# EAGLE design IoTNodeWeatherandWaterAdapterFeb2019v0 (EAGLE 9.3.0)
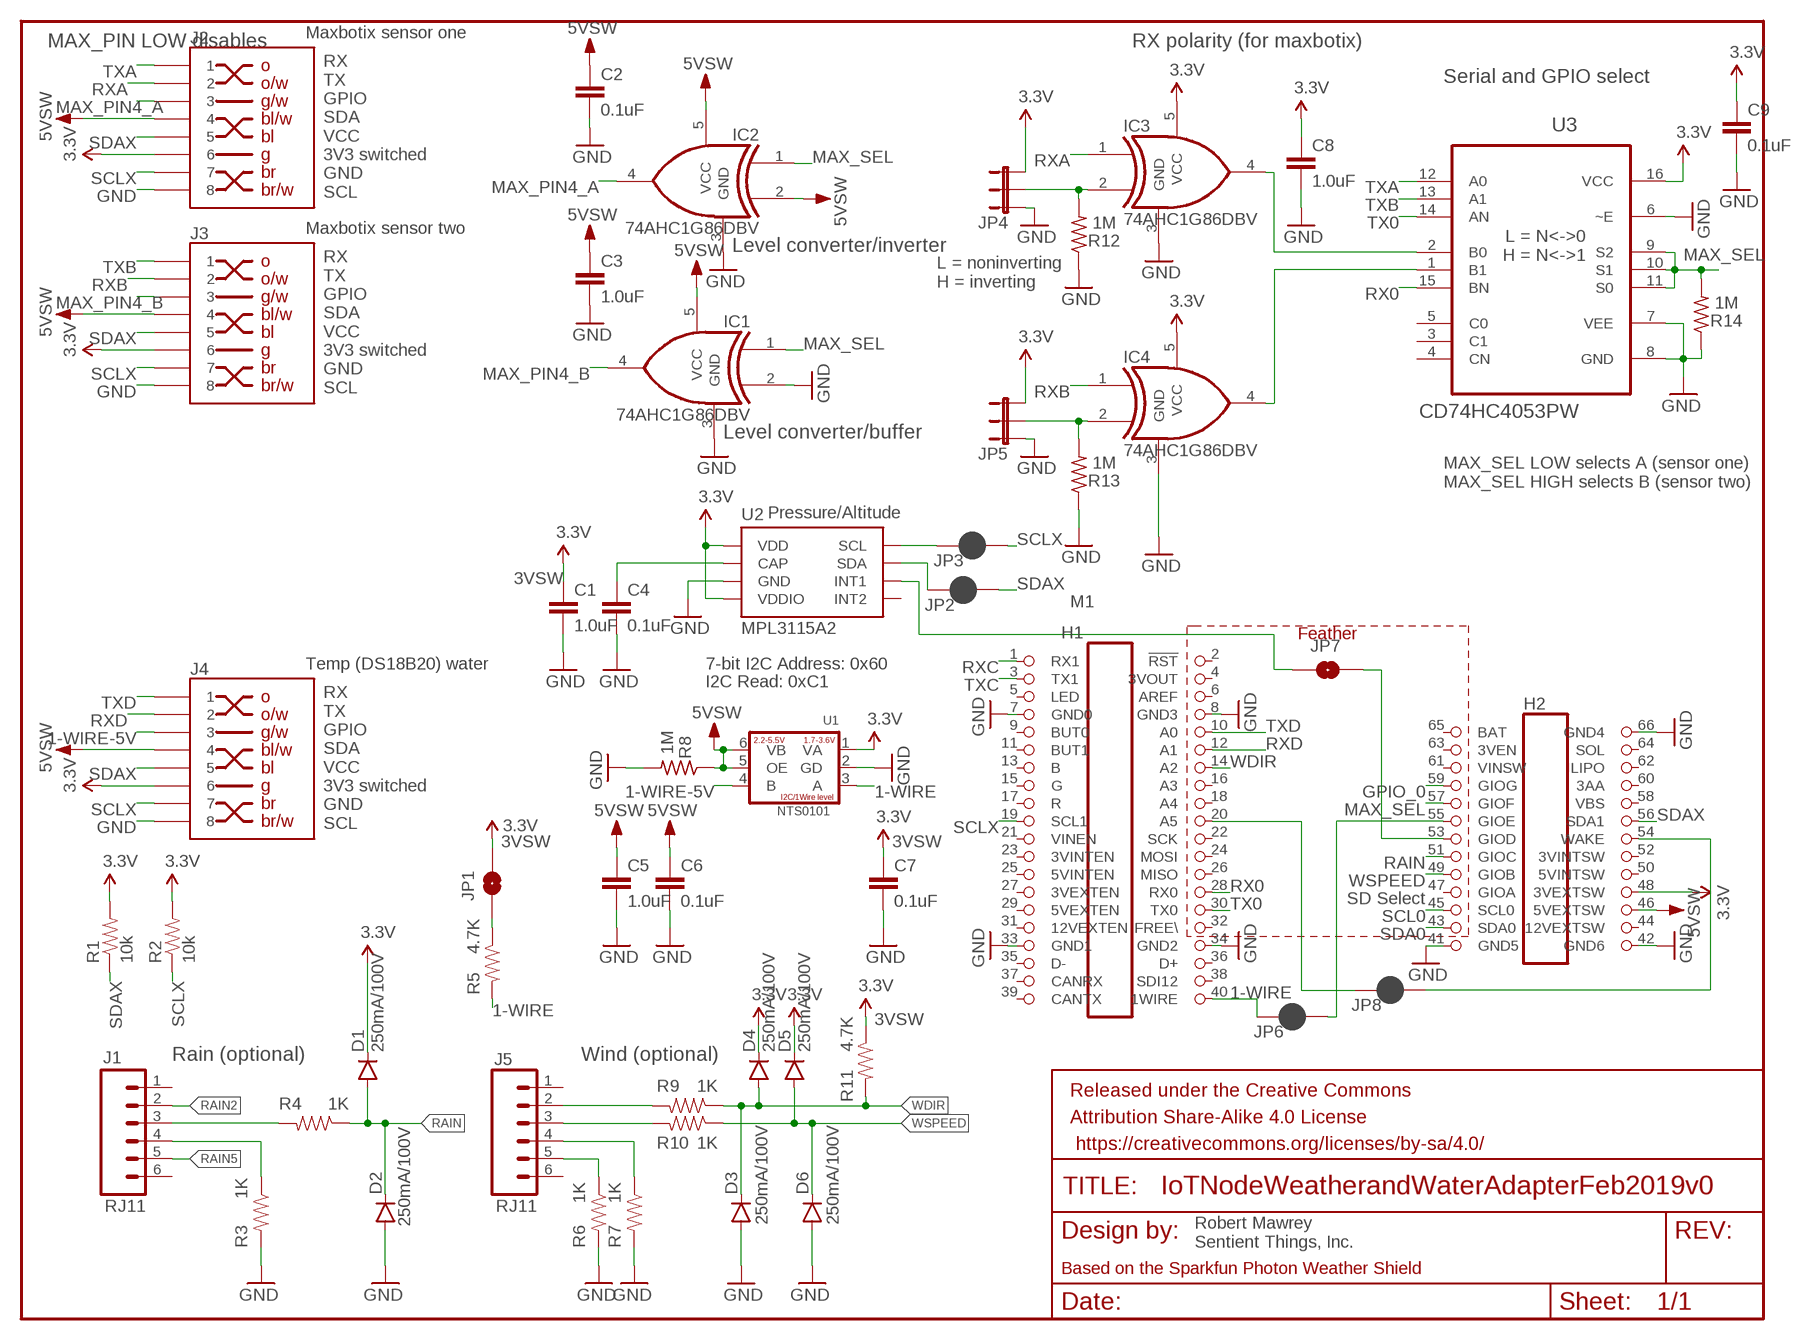
[diagram p0: schematic, sheet 1]

## Parts
C1  1.0uF  1.0UF-16V-10%(0603)  [0603-CAP]
C2  0.1uF  0.1UF-25V(+80/-20%)(0603)  [0603-CAP]
C3  1.0uF  1.0UF-16V-10%(0603)  [0603-CAP]
C4  0.1uF  0.1UF-25V(+80/-20%)(0603)  [0603-CAP]
C5  1.0uF  1.0UF-16V-10%(0603)  [0603-CAP]
C6  0.1uF  0.1UF-25V(+80/-20%)(0603)  [0603-CAP]
C7  0.1uF  0.1UF-25V(+80/-20%)(0603)  [0603-CAP]
C8  1.0uF  1.0UF-16V-10%(0603)  [0603-CAP]
C9  0.1uF  0.1UF-25V(+80/-20%)(0603)  [0603-CAP]
D1  250mA/100V  DIODEBAS16  [SOD-323]
D2  250mA/100V  DIODEBAS16  [SOD-323]
D3  250mA/100V  DIODEBAS16  [SOD-323]
D4  250mA/100V  DIODEBAS16  [SOD-323]
D5  250mA/100V  DIODEBAS16  [SOD-323]
D6  250mA/100V  DIODEBAS16  [SOD-323]
FRAME1  FRAME-LETTER  [CREATIVE_COMMONS]
H1  IOTNODE2X20PLACEMENT  [2X20PLACEMENT]
H2  IOTNODE2X13PLACEMENT  [2X13PLACEMENT]
IC1  74AHC1G86DBV  [SOT23-5]
IC2  74AHC1G86DBV  [SOT23-5]
IC3  74AHC1G86DBV  [SOT23-5]
IC4  74AHC1G86DBV  [SOT23-5]
J1  RJ11  RJ11-6PTH  [RJ11-6]
J2  RJ45-8-UP  [RJHSE-5080]
J3  RJ45-8-UP  [RJHSE-5080]
J4  RJ45-8-UP  [RJHSE-5080]
J5  RJ11  RJ11-6PTH  [RJ11-6]
JP1  JUMPER-PAD-2-NOYES_SILK  [PAD-JUMPER-2-NO_YES_SILK]
JP2  JUMPER-SMT_2_NC_PASTE_NO-SILK  [SMT-JUMPER_2_NC_PASTE_NO-SILK]
JP3  JUMPER-SMT_2_NC_PASTE_NO-SILK  [SMT-JUMPER_2_NC_PASTE_NO-SILK]
JP4  JUMPER-3LOCK  [1X03_LOCK]
JP5  JUMPER-3LOCK  [1X03_LOCK]
JP6  JUMPER-SMT_2_NC_PASTE_NO-SILK  [SMT-JUMPER_2_NC_PASTE_NO-SILK]
JP7  JUMPER-SMT_2_NO_NO-SILK  [SMT-JUMPER_2_NO_NO-SILK]
JP8  JUMPER-SMT_2_NC_PASTE_NO-SILK  [SMT-JUMPER_2_NC_PASTE_NO-SILK]
M1  IOTNODEFEATHERWING  [IOTNODEFEATHERWING]
R1  10k  RESISTOR0603-RES  [0603-RES]
R2  10k  RESISTOR0603-RES  [0603-RES]
R3  1K  1KOHM-1/10W-1%(0603)  [0603-RES]
R4  1K  1KOHM-1/10W-1%(0603)  [0603-RES]
R5  4.7K  4.7KOHM-1/10W-1%(0603)  [0603-RES]
R6  1K  1KOHM-1/10W-1%(0603)  [0603-RES]
R7  1K  1KOHM-1/10W-1%(0603)  [0603-RES]
R8  1M  R_0603  [0603]
R9  1K  1KOHM-1/10W-1%(0603)  [0603-RES]
R10  1K  1KOHM-1/10W-1%(0603)  [0603-RES]
R11  4.7K  4.7KOHM-1/10W-1%(0603)  [0603-RES]
R12  1M  R_0603  [0603]
R13  1M  R_0603  [0603]
R14  1M  R_0603  [0603]
U1  NTS0101  NTS0101-SC-88  [SOT363_PHILIPS]
U2  MPL3115A2  [LGA-8-5X3]
U3  CD74HC4053PW  [SOP65P640X120-16N]

## Nets
1-WIRE: JP6.2 M1.40(1WIRE) R5.2 U1.3(A)
1-WIRE-5V: J4.3 U1.4(B)
3VSW: C1.1 C7.1 C8.1 C9.1 D1.C D4.C D5.C IC3.5(VCC) IC4.5(VCC) J2.6 J3.6 J4.6 JP1.2 JP4.3 JP5.3 M1.48(3VEXTSW) R1.2 R2.2 R11.1 U1.1(VA) U2.1(VDD) U2.4(VDDIO) U3.16(VCC) ; supply symbol labelled 3.3V
5VSW [Power]: C2.1 C3.1 C5.1 C6.1 IC1.5(VCC) IC2.2(I1) IC2.5(VCC) J2.4 J3.4 J4.4 M1.46(5VEXTSW) R8.1 U1.5(OE) U1.6(VB)
GND [Power]: C1.2 C2.2 C3.2 C4.2 C5.2 C6.2 C7.2 C8.2 C9.2 D2.A D3.A D6.A IC1.2(I1) IC1.3(GND) IC2.3(GND) IC3.3(GND) IC4.3(GND) J2.8 J3.8 J4.8 JP4.1 JP5.1 M1.7(GND0) M1.8(GND3) M1.33(GND1) M1.34(GND2) M1.41(GND5) M1.42(GND6) M1.66(GND4) R3.2 R6.2 R7.2 R8.2 R12.1 R13.1 R14.1 U1.2(GD) U2.3(GND) U3.6(~E) U3.7(VEE) U3.8(GND)
GPIO_0: M1.59(GIOG)
MAX_PIN4_A: IC2.4(O) J2.3
MAX_PIN4_B: IC1.4(O) J3.3
MAX_SEL: IC1.1(I0) IC2.1(I0) M1.57(GIOF) R14.2 U3.9(S2) U3.10(S1) U3.11(S0)
N$1: J5.3 R10.2
N$2: J5.2 R9.2
N$4: J1.3 R4.2
N$5: C4.1 U2.2(CAP)
N$9: JP6.1 M1.55(GIOE)
N$10: JP7.1 U2.6(INT1)
N$11: J1.4 R3.1
N$12: J5.5 R6.1
N$13: J5.4 R7.1
N$14: IC3.4(O) U3.2(B0)
N$15: IC4.4(O) U3.1(B1)
N$17: JP8.2 M1.20(A5)
N$18: JP7.2 M1.53(GIOD)
N$22: IC4.2(I1) JP5.2 R13.2
N$23: JP3.2 U2.8(SCL)
N$25: JP8.1 M1.54(WAKE)
N$26: JP2.2 U2.7(SDA)
N$28: JP1.1 R5.1
RA: IC3.2(I1) JP4.2 R12.2
RAIN: D1.A D2.C M1.51(GIOC) R4.1
RAIN2: J1.2
RAIN5: J1.5
RX0: M1.28(RX0) U3.15(BN)
RXA: IC3.1(I0) J2.2
RXB: IC4.1(I0) J3.2
RXC: M1.1(RX1)
RXD: J4.2 M1.12(A1)
SCL0: M1.45(SCL0)
SCLX: J2.7 J3.7 J4.7 JP3.1 M1.19(SCL1) R2.1
SDA0: M1.43(SDA0)
SDAX: J2.5 J3.5 J4.5 JP2.1 M1.56(SDA1) R1.1
TX0: M1.30(TX0) U3.14(AN)
TXA: J2.1 U3.12(A0)
TXB: J3.1 U3.13(A1)
TXC: M1.3(TX1)
TXD: J4.1 M1.10(A0)
WDIR: D3.C D4.A M1.14(A2) R9.1 R11.2
WSPEED: D5.A D6.C M1.49(GIOB) R10.1
Unconnected: J1.1 J1.6 J5.1 J5.6 M1.2(!RST) M1.4(3VOUT) M1.5(LED) M1.6(AREF) M1.9(BUT0) M1.11(BUT1) M1.13(B) M1.15(G) M1.16(A3) M1.17(R) M1.18(A4) M1.21(VINEN) M1.22(SCK) M1.23(3VINTEN) M1.24(MOSI) M1.25(5VINTEN) M1.26(MISO) M1.27(3VEXTEN) M1.29(5VEXTEN) M1.31(12VEXTEN) M1.32(FREE\) M1.35(D-) M1.36(D+) M1.37(CANRX) M1.38(SDI12) M1.39(CANTX) M1.44(12VEXTSW) M1.47(GIOA) M1.50(5VINTSW) M1.52(3VINTSW) M1.58(VBS) M1.60(3AA) M1.61(VINSW) M1.62(LIPO) M1.63(3VEN) M1.64(SOL) M1.65(BAT) U2.5(INT2) U3.3(C1) U3.4(CN) U3.5(C0)

## Notes on the sheet
- Maxbotix sensor one
- MAX_PIN LOW disables | RX polarity (for maxbotix)
- Serial and GPIO select
- RX
  TX
  GPIO
  SDA
  VCC
  3V3 switched
  GND
  SCL
- Maxbotix sensor two
- Level converter/inverter
- L = N<->0
  H = N<->1
- L = noninverting
  H = inverting
- RX
  TX
  GPIO
  SDA
  VCC
  3V3 switched
  GND
  SCL
- Level converter/buffer
- MAX_SEL LOW selects A (sensor one)
  MAX_SEL HIGH selects B (sensor two)
- Pressure/Altitude
- Temp (DS18B20) water | 7-bit I2C Address: 0x60
- I2C Read: 0xC1
- RX
  TX
  GPIO
  SDA
  VCC
  3V3 switched
  GND
  SCL
- SD Select
- Rain (optional) | Wind (optional)
- Robert Mawrey
  Sentient Things, Inc.
- Based on the Sparkfun Photon Weather Shield

## Library data of the parts
C1 C3 C5 C8 = SparkFun-Capacitors:1.0UF-16V-10%(0603): CAP-00868; PARTNO: CC0603KRX7R8BB105; PROD_ID: CAP-00868
C2 C4 C6 C7 C9 = SparkFun-Capacitors:0.1UF-25V(+80/-20%)(0603): CAP-00810 Ceramic Standard decoupling cap; PARTNO: C1608X5R1H104K080AA; PROD_ID: CAP-00810
D1-D6 = SparkFun-DiscreteSemi:DIODE: Diode These are standard reverse protection diodes and small signal diodes. SMA package can handle up to about 1A. SOD-323 can handle about 200mA. What the SOD-323 package when ordering, there are some mfgs out there that are 5-pin packages.; PARTNO: BAS16J,135; PROD_ID: DIO-09646
FRAME1 = Mawrey:FRAME-LETTER: Schematic Frame Standard 8.5x11 US Letter frame; PARTNO: DNP
H1 = Mawrey:IOTNODE2X20PLACEMENT
H2 = Mawrey:IOTNODE2X13PLACEMENT
IC1-IC4 = Mawrey:74*1G86: 2-input EXCLUSIV-OR gate; PARTNO: SN74AHC1G86DBVR
J1 J5 = SparkFun-Connectors:RJ11-6: RJ11 Jack Simple 6 pin RJ11 jack. Commonly found on CAT3 devices and Microchip programmers. SKU: PRT-00132; PARTNO: 5555165-1; PROD_ID: CONN-08590
J2-J4 = Mawrey:RJ45-8: RJ45 Jack Simple RJ45, 8-pin connection - connector for common Cat5, Cat5e, and Cat6 Ethernet cables. Footprint not yet proven in production. Connector sku is PRT-00643; Breakout PCB sku is BOB-00716.; PARTNO: RJHSE-5080
JP1 = iotNodeTempIoT Node baseboard2:JUMPER-PAD-2-NO; PARTNO: DNP
JP2 JP3 JP6 JP8 = SparkFun-Jumpers:JUMPER-SMT_2_NC_PASTE: Normally closed solder jumper This jumper has an aperture in the stencil to allow solder paste to bridge the split in the wire so it's normally closed (NC). Wick off the solder to open the connection. Reapply solder to reclose the connection.; PARTNO: DNP
JP4 JP5 = Mawrey:JUMPER-3; PARTNO: 68000-103HLF
JP7 = SparkFun-Jumpers:JUMPER-SMT_2_NO: Normally open jumper This jumper has two pads in close proximity to each other. Apply solder to close the connection. Round pads are easier to solder for beginners, but are a lot larger. SparkFun Product that uses the round pads: SparkFun EL Sequencer <https://www.sparkfun.com/products/12781>; PARTNO: DNP
M1 = Mawrey:IOTNODEFEATHERWING; PARTNO: DNP
R1 R2 = Mawrey:RESISTOR: Resistor Basic schematic elements and footprints for 0603, 1206, and PTH 1/10th watt (small) resistors.; PARTNO: ERJ-3GEYJ103V
R3 R4 R6 R7 R9 R10 = SparkFun-Resistors:1KOHM-1/10W-1%(0603): RES-07856; PARTNO: RC0603JR-071KL; PROD_ID: RES-07856
R5 R11 = SparkFun-Resistors:4.7KOHM-1/10W-1%(0603): RES-07857; PARTNO: RC0603JR-074K7L; PROD_ID: RES-07857
R8 R12-R14 = Particle:R_0603; PARTNO: RC0603FR-071ML
U1 = Mawrey:NTS0101: The NTS0101 is a 1-bit, dual supply translating transceiver with auto direction sensing, that enables bidirectional voltage level translation. I2C or 1-wire.; PARTNO: NTS0101GW,125
U2 = Mawrey:MPL3115A2: NXP MPL3115A2 Digital Altimeter/Pressure Sensor The MPL3115A2 is a compact piezoresistive absolute pressure sensor with an I2C interface. MPL3115 has a wide operating range of 20kPa to 110 kPa, a range that covers all surface elevations on Earth. The fully internally compensated MEMS in conjunction with an embedded high resolution 24-bit equivalent ADC provide accurate pressure [Pascals] /altitude [meters] and temperature [degrees Celsius] data. Datasheet <http://cdn.sparkfun.com/datasheets/Sensors/Pressure/MPL3115A2.pdf> SparkFun Products SparkFun Altitude/Pressure Sensor Breakout - MPL3115A2 <https://www.sparkfun.com/products/11084> (SEN-11084) SparkFun Weather Shield <https://www.sparkfun.com/products/12081> (DEV-12081) SparkFun Photon Weather Shield <https://www.sparkfun.com/products/13630> (DEV-13630); PARTNO: MPL3115A2; PROD_ID: IC-10869
U3 = Texas Instruments_By_element14_Batch_1:CD74HC4053PW: High-Speed CMOS Logic Analog Multiplexers/Demultiplexers; MPN: CD74HC4053PW; OC_FARNELL: 1595410; OC_NEWARK: -; PACKAGE: TSSOP-16; PARTNO: 74HC4053PW,118; SUPPLIER: Texas Instruments

## Net classes
0 default: width 0.254 mm, drill 0.508 mm, clearance 0.203 mm
1 Power: width 0.762 mm, drill 0.508 mm, clearance 0.203 mm

## Board
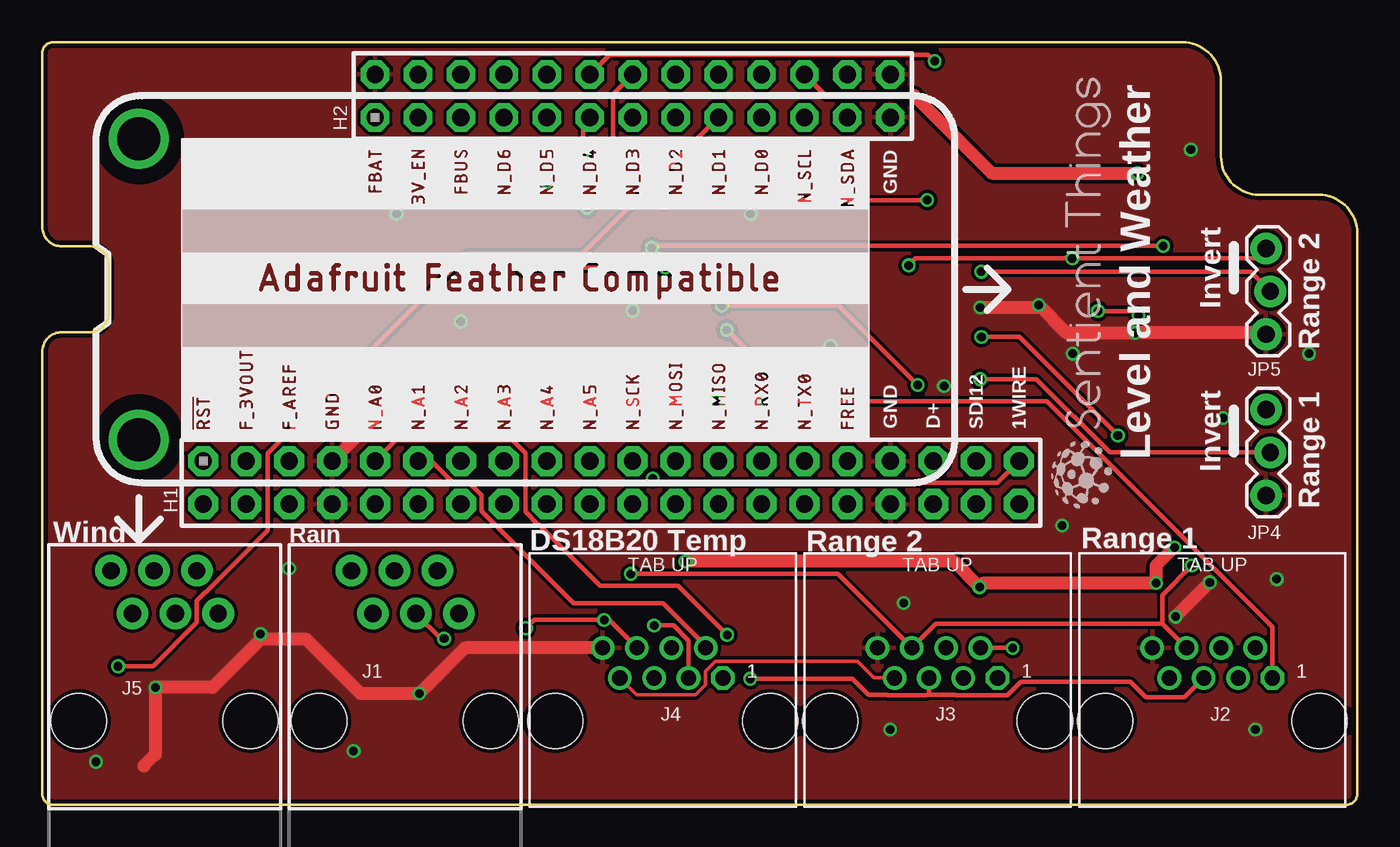
[diagram p1: board, top side]
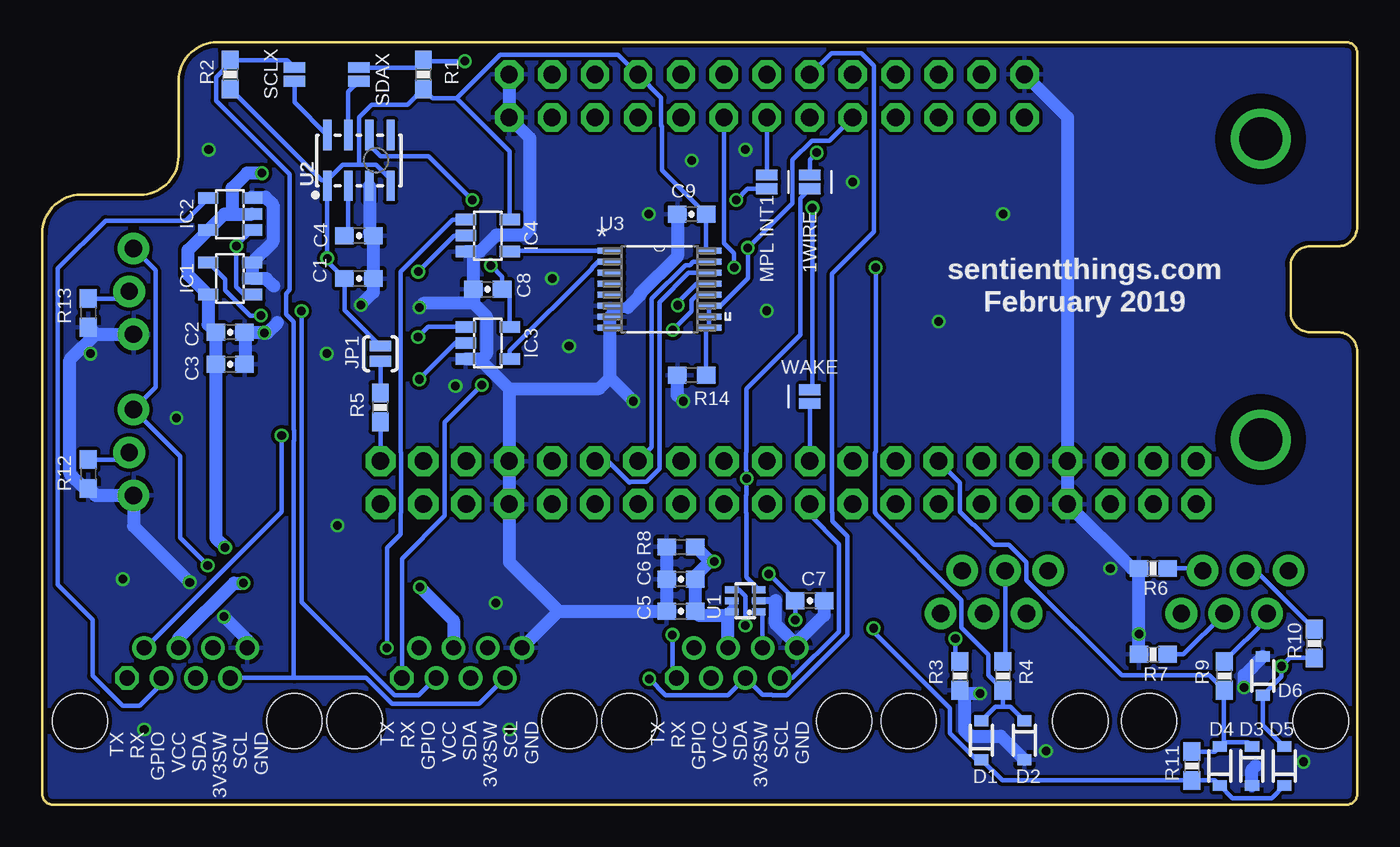
[diagram p2: board, bottom side, seen from below]

Size 77.79 x 45.09 mm. Coordinates in mm from the lower left corner, seen from the top.
Outline: 0,26.8 0,0.64 arc90 0.63,0 77.15,0 arc90 77.79,0.64 77.79,33.78 arc90 75.5,36.07 72.01,36.07 arc-90 69.72,38.35 69.72,42.8 arc90 67.44,45.09 0.63,45.09 arc90 0,44.45 0,34.16 arc90 1.14,33.02 2.79,33.02 arc-90 3.94,31.88 3.94,29.08 arc-90 2.79,27.94 1.14,27.94 arc90 0,26.8
Copper layers (1*16): Top 0.035mm / dielectric 1.5mm / Bottom 0.035mm
Design rules "SeeedStudio_2layer_DRU_no_angle_20140221 *": minimum track width 6mil, minimum drill 20mil, track to track 6mil, track to pad 6mil, pad to pad 6mil, via to via 6mil, smd to smd 0mil, copper to edge 10mil, drill to drill 10mil, minimum pad ring 10mil, minimum via ring 6mil, stop-mask expansion 2mil, vias tented up to drill 100mil, thermal gap 10mil

### Footprints (pad centres in the part's own frame; a part is rotated, then mirrored left to right if it is on the bottom)
0603-CAP = smd 1.1 x 1: 1 -0.85,0; 2 0.85,0
SOD-323 = smd 0.63 x 0.83: A 1.15,0; C -1.15,0
SOT23-5 = smd 0.69 x 1.2: 1 -0.95,-1.3; 2 0,-1.3; 3 0.95,-1.3; 4 0.95,1.3; 5 -0.95,1.3
RJ11-6 = drill 1.016 pad 1.88: 1 -3.175,8.89; 2 -1.905,6.35; 3 -0.635,8.89; 4 0.635,6.35; 5 1.905,8.89; 6 3.175,6.35 | hole 3.251: -5.08,0; 5.08,0
RJHSE-5080 = drill 0.889 octagon: 1 3.556,0 | drill 0.889: 2 2.54,1.778; 3 1.524,0; 4 0.508,1.778; 5 -0.508,0; 6 -1.524,1.778; 7 -2.54,0; 8 -3.556,1.778 | hole 3.251: 6.35,-2.54; -6.35,-2.54
PAD-JUMPER-2-NO_YES_SILK = smd 0.635 x 1.27: 1 -0.45,0; 2 0.45,0
SMT-JUMPER_2_NC_PASTE_NO-SILK = smd 0.635 x 1.27: 1 -0.406,0; 2 0.406,0
1X03_LOCK = drill 1.016 pad 1.88: 1 0,0.127; 2 2.54,-0.127; 3 5.08,0.127
SMT-JUMPER_2_NO_NO-SILK = smd 0.635 x 1.27: 1 -0.406,0; 2 0.406,0
IOTNODEFEATHERWING = drill 1.016 pad 1.778 octagon: 1 -6.35,-2.54; 2 -6.35,0; 3 -3.81,-2.54; 4 -3.81,0; 5 -1.27,-2.54; 6 -1.27,0; 7 1.27,-2.54; 8 1.27,0; 9 3.81,-2.54; 10 3.81,0; 11 6.35,-2.54; 12 6.35,0; 13 8.89,-2.54; 14 8.89,0; 15 11.43,-2.54; 16 11.43,0; 17 13.97,-2.54; 18 13.97,0; 19 16.51,-2.54; 20 16.51,0; 21 19.05,-2.54; 22 19.05,0; 23 21.59,-2.54; 24 21.59,0; 25 24.13,-2.54; 26 24.13,0; 27 26.67,-2.54; 28 26.67,0; 29 29.21,-2.54; 30 29.21,0; 31 31.75,-2.54; 32 31.75,0; 33 34.29,-2.54; 34 34.29,0; 35 36.83,-2.54; 36 36.83,0; 37 39.37,-2.54; 38 39.37,0; 39 41.91,-2.54; 40 41.91,0 | drill 1.016 pad 1.676 octagon: 41 34.29,20.32; 42 34.29,22.86; 43 31.75,20.32; 44 31.75,22.86; 45 29.21,20.32; 46 29.21,22.86; 47 26.67,20.32; 48 26.67,22.86; 49 24.13,20.32; 50 24.13,22.86; 51 21.59,20.32; 52 21.59,22.86; 53 19.05,20.32; 54 19.05,22.86; 55 16.51,20.32; 56 16.51,22.86; 57 13.97,20.32; 58 13.97,22.86; 59 11.43,20.32; 60 11.43,22.86; 61 8.89,20.32; 62 8.89,22.86; 63 6.35,20.32; 64 6.35,22.86; 65 3.81,20.32; 66 3.81,22.86 | drill 2.54: P$1 -10.16,19.05; P$2 -10.16,1.27
0603-RES = smd 1.1 x 1: 1 -0.85,0; 2 0.85,0
0603 = smd 1.1 x 1: 1 -0.85,0; 2 0.85,0
SOT363_PHILIPS = smd 0.4 x 0.8: 1 -0.65,-0.8; 2 0,-0.8; 3 0.65,-0.8; 4 0.65,0.8; 5 0,0.8; 6 -0.65,0.8
LGA-8-5X3 = smd 1.8 x 0.5: 1 -1.5,1.875; 2 -1.5,0.625; 3 -1.5,-0.625; 4 -1.5,-1.875; 5 1.5,-1.875; 6 1.5,-0.625; 7 1.5,0.625; 8 1.5,1.875
SOP65P640X120-16N = smd 1.473 x 0.356: 1 -2.921,2.286; 2 -2.921,1.626; 3 -2.921,0.965; 4 -2.921,0.33; 5 -2.921,-0.33; 6 -2.921,-0.965; 7 -2.921,-1.626; 8 -2.921,-2.286; 9 2.921,-2.286; 10 2.921,-1.626; 11 2.921,-0.965; 12 2.921,-0.33; 13 2.921,0.33; 14 2.921,0.965; 15 2.921,1.626; 16 2.921,2.286

### Placement (x,y rotation side)
C1  59.05,31.12 0 bottom
C2  66.67,27.94 0 bottom
C3  66.67,26.04 0 bottom
C4  59.05,33.66 0 bottom
C5  40.01,11.43 180 bottom
C6  40.01,13.34 180 bottom
C7  32.38,12.06 0 bottom
C8  51.43,30.48 180 bottom
C9  39.37,34.92 180 bottom
D1  22.23,3.81 90 bottom
D2  19.69,3.81 270 bottom
D3  6.22,2.29 270 bottom
D4  8.13,2.29 90 bottom
D5  4.32,2.29 90 bottom
D6  5.59,7.62 90 bottom
FRAME1  21.97,-45.97 0 top  (outside the outline)
H1  9.53,17.78 0 top
H2  19.69,40.64 0 top
IC1  66.67,31.12 90 bottom
IC2  66.67,34.92 90 bottom
IC3  51.43,27.3 270 bottom
IC4  51.43,33.66 270 bottom
J1  21.46,4.95 0 top
J2  69.22,7.49 0 top
J3  52.96,7.49 0 top
J4  36.7,7.49 0 top
J5  7.24,4.95 0 top
JP1  57.78,26.67 90 bottom
JP2  59.05,43.18 270 bottom
JP3  62.87,43.18 270 bottom
JP4  72.52,18.29 90 top
JP5  72.52,27.81 90 top
JP6  32.38,36.83 270 bottom
JP7  34.92,36.83 90 bottom
JP8  32.38,24.13 270 bottom
M1  15.88,20.32 0 top
R1  55.24,43.18 270 bottom
R2  66.67,43.18 270 bottom
R3  23.5,7.62 270 bottom
R4  20.95,7.62 90 bottom
R5  57.78,23.5 270 bottom
R6  12.07,13.97 180 bottom
R7  12.07,8.89 180 bottom
R8  40.01,15.24 180 bottom
R9  7.87,7.62 90 bottom
R10  2.54,9.53 90 bottom
R11  9.78,2.29 90 bottom
R12  75.06,19.56 90 bottom
R13  75.06,29.08 90 bottom
R14  39.37,25.4 0 bottom
U1  36.2,12.06 90 bottom
U2  59.05,38.1 90 bottom
U3  41.27,30.48 0 bottom
U$1  [SENTIENT_TSILK]  49.53,33.66 0 top
U$2  [SENTIENT_THINGS]  63.37,17.53 90 top
U$3  [IOTNODEINSIDESILK]  9.53,20.32 0 top

### Tracks (layer width: path | path; a pad name or v marks a point on that pad's centre or on a via)
1-WIRE  (via drill 0.51 pad 0.81)
  Top 0.254: M1.40 56.52,19.05 36.37,19.05 v36.12,19.3
  Bottom 0.254: JP6.2 32.95,35.86 32.95,27.78 36.12,24.61 36.12,20.85 36.14,20.82 36.14,19.82 36.12,19.79 v36.12,19.3 36.12,18.31 36.14,18.29 36.14,17.27 36.12,17.25 36.12,13.44 U1.3 | M1.40 R5.2
1-WIRE-5V  (via drill 0.51 pad 0.81)
  Top 0.254: J4.3 38.24,7.51 38.24,9.7 37.34,10.6 v36.2,10.6
  Bottom 0.254: U1.4 36.57,12.71 36.2,12.34 v36.2,10.6
3VSW  (via drill 0.51 pad 0.81)
  Top 0.254: v34.81,13.65 47.06,13.65 J3.6 52.88,10.71 66.25,10.71 | v51.25,31.89 51.66,32.31 v60.93,32.31 71.81,32.31 JP5.3 | v68,14.15 66.25,12.4 66.25,10.71 | 66.25,10.71 J2.6 | v33.23,10.92 29.1,10.92 v28.62,10.44 | J4.6 33.53,10.92 v33.23,10.92 | v33.23,10.92
  Bottom 0.254: 59.05,37.83 58.96,37.83 58.03,37.83 57.18,36.98 U2.4 | 59.05,37.83 60.02,37.83 60.93,36.92 | 60.93,36.92 U2.1 v60.93,32.31 60.93,32.14 C1.1 59.91,29.24 JP1.2 | R2.2 61.27,36.92 60.93,36.92 | v34.81,13.65 33.23,12.08 C7.1 v33.23,10.92 | J4.6 35.18,11.2 U1.1 | v51.25,31.89 50.59,31.23 C8.1 50.13,30.03 IC3.5 | v68,14.15 69.63,15.78 69.63,20.61 JP4.3 71.09,24.67 71.09,31.59 JP5.3 | v28.62,10.44 28.62,10.22 24.09,5.7 24.09,4.23 22.52,2.66 D1.C 21,1.44 R11.1 8.43,1.44 D4.C 7.38,0.39 5.06,0.39 D5.C | U3.16 38.52,32.93 C9.1 41.12,37.53 41.12,40.11 41.17,40.16 41.17,41.81 M1.48 43.72,44.36 50.71,44.36 53.29,41.78 | IC4.5 50.13,38.63 53.29,41.78 | 53.29,41.78 54.7,41.78 R1.2 56.17,41.4 58.29,41.4 59.05,40.64 59.05,37.83
5VSW  (via drill 0.51 pad 0.81)
  Top 0.305: M1.46 46.33,41.94 51.58,41.94
  Top 0.762: v38.05,14.39 53.91,14.39 v55.44,12.86 55.69,13.11 v65.89,13.11 65.89,14.13 v66.97,15.21 | 51.58,41.94 56.17,37.34 v64.79,37.34
  Bottom 0.4: U1.5 U1.6
  Bottom 0.762: 38.3,14.39 R8.1 | v38.05,14.39 38.3,14.39 | 38.3,14.39 39.16,13.53 C6.1 C5.1 38.92,11.2 37.21,11.2 | v55.44,12.86 53.47,10.89 J3.4 | 66.56,34.92 IC2.2 | 66.56,34.92 67.03,34.92 IC2.5 69.16,32.79 69.16,31.35 IC1.5 67.98,28.39 C2.1 C3.1 67.53,15.77 v66.97,15.21 | v64.79,37.34 65.68,37.34 66.56,36.46 66.56,34.92 | 37.21,11.2 U1.6 | J4.4 37.21,11.2 | J2.4 69.72,9.84 66.45,13.11 v65.89,13.11
GND  (via drill 0.51 pad 0.81)
  Top 0.762: 12.92,9.78 15.62,9.78 18.83,6.57 v22.31,6.57 25.01,9.27 J4.8 | 6,2.3 6.69,2.98 v6.69,6.93 10.07,6.93 12.92,9.78 | v12.92,10.09 12.92,9.78 | v69.07,13.15 v67.04,11.12 | v42.82,23.86 v39.87,23.86 20.68,23.86 M1.8 | v55.48,29.41 58.8,29.41 v58.95,29.55 60.59,27.9 v64.65,27.9 72.3,27.9 JP5.1
  Bottom 0.355: 44.07,29.39 U3.6
  Bottom 0.4: 34.41,12.06 U1.2
  Bottom 0.61: 44.07,28.98 44.07,29.39 43.16,29.39
  Bottom 0.69: IC2.3 65.38,35.92
  Bottom 0.762: 47.24,11.43 C5.2 C6.2 R8.2 | J3.8 47.24,11.43 | 47.24,11.43 50.16,14.35 M1.33 M1.34 50.16,24.6 | M1.66 17.14,40.64 M1.8 M1.7 13.34,13.97 R6.2 v12.92,10.09 R7.2 | 23.23,6.57 23.3,6.57 R3.2 | v22.31,6.57 23.23,6.57 | 23.23,6.57 23.23,4.38 22.91,4.06 21.09,4.06 D2.A | D3.A 6.22,2.07 6,2.3 | 65.79,27.9 C2.2 | 65.79,27.9 v64.65,27.9 64.48,27.9 63.87,28.51 | 65.79,27.9 65.79,26.07 C3.2 | 44.07,28.98 U3.7 U3.8 44.2,25.25 44.2,25.24 | v6.69,6.93 6.69,7.67 D6.A | v69.07,13.15 72.39,16.47 JP4.1 74.64,18.29 R12.1 75.27,18.71 76.15,19.58 76.15,26.3 74.64,27.81 | 52.28,32.7 IC4.3 | 52.28,32.7 C8.2 52.28,29.64 | 52.28,32.7 51.91,32.7 50.94,33.68 49.29,33.68 48.95,34.02 48.95,39.42 M1.41 M1.42 | 50.16,24.6 44.85,24.6 44.2,25.24 | 44.2,25.24 v42.82,23.86 | v67.04,11.12 65.66,9.74 J2.8 | U2.3 58.43,33.88 C4.2 C1.2 58.2,30.29 v58.95,29.55 | 52.28,29.64 51.52,28.87 51.52,26.64 51.8,26.36 | 52.28,29.64 55.24,29.64 v55.48,29.41 | 51.8,26.36 51.8,26.24 50.16,24.6 | 51.8,26.36 IC3.3 | v39.87,23.86 40.22,24.21 R14.1 | 33.15,9.65 33.37,9.65 34.41,10.7 34.41,12.06 | C7.2 31.54,11.2 33.08,9.65 33.15,9.65 | 33.15,9.65 J4.8 | 65.38,35.92 64.6,35.92 64.14,35.46 64.14,33.3 IC1.3 IC1.2 64.53,31.12 64.08,30.66 | 74.64,27.81 JP5.1 | R13.1 74.64,27.81 | C9.2 40.22,32.42 42.44,30.2 42.44,30.1 43.16,29.39
  other vias: 50.16,4.45 60.32,16.51 60.96,26.67 69.85,22.86 73.03,13.34 71.75,4.45 74.93,26.67 67.95,38.73 53.34,24.77 41.91,34.92 39.37,38.1 36.2,38.73 29.84,36.83 24.77,28.58 20.95,34.92 18.41,3.18 3.18,2.54 14.61,13.97 34.92,29.21 47.62,31.12 46.62,27.12 50.95,11.93
  pour Top: -3.17,46.99 80.65,46.99 80.65,-2.54 -3.17,-2.54
  pour Bottom: -3.81,50.8 81.15,50.8 81.15,-5.08 -3.81,-5.08
MAX_PIN4_A
  Bottom 0.254: IC2.4 69.31,34.54 74.04,34.54 76.87,31.72 76.87,13 74.8,10.94 74.8,7.62 73.03,5.84 72.01,5.84 70.74,7.11 J2.3
MAX_PIN4_B  (via drill 0.51 pad 0.81)
  Top 0.254: v64.86,28.92 64.6,29.19 v62.45,29.19
  Bottom 0.254: v64.86,28.92 65.49,28.92 66.98,30.41 66.98,31.07 IC1.4 | J3.3 55.51,6.46 56.94,6.46 57.54,7.07 62.45,11.97 62.45,21.33 62.43,21.34 62.43,22.33 62.45,22.35 v62.45,29.19
MAX_SEL  (via drill 0.51 pad 0.81)
  Top 0.254: v36.05,32.93 36.17,33.04 v66.31,33.04
  Bottom 0.254: M1.57 31.21,39.27 32.27,39.27 33.4,38.14 33.4,35.57 v36.05,32.93 36.05,31.14 37.68,29.52 U3.11 U3.10 U3.9 38.52,28.03 R14.2 | IC2.1 v66.31,33.04 66.31,30.63 65.84,30.16 IC1.1
N$1
  Bottom 0.254: R10.2 6.01,13.84 J5.3
N$2
  Bottom 0.254: R9.2 5.33,11.01 J5.2
N$4
  Bottom 0.254: R4.2 20.83,8.6 J1.3
N$5
  Bottom 0.254: U2.2 59.68,33.88 C4.1
N$9  (via drill 0.51 pad 0.81)
  Top 0.254: M1.55 31.98,40.23 v31.98,38.56
  Bottom 0.254: v31.98,38.56 32.38,38.15 JP6.1
N$10  (via drill 0.51 pad 0.81)
  Top 0.254: v36.73,35.75 v52.34,35.75
  Bottom 0.254: 58.43,39.3 U2.6 58.43,39 57.78,38.35 54.95,38.35 v52.34,35.75 | v36.73,35.75 36.06,36.42 JP7.1
N$11  (via drill 0.51 pad 0.81)
  Top 0.254: v23.77,9.82 23.58,9.82 J1.4
  Bottom 0.254: R3.1 23.77,8.75 v23.77,9.82
N$12
  Bottom 0.254: R6.1 9.27,13.97 J5.5
N$13
  Bottom 0.254: R7.1 10.29,8.89 J5.4
N$14
  Bottom 0.254: IC3.4 50.13,26.83 45.26,31.7 45.26,31.76 44.92,32.11 U3.2
N$15
  Bottom 0.254: U3.1 50.07,32.77 IC4.4
N$17
  Bottom 0.254: M1.20 JP8.2
N$18
  Bottom 0.254: M1.53 JP7.2
N$22  (via drill 0.51 pad 0.81)
  Top 0.254: JP5.2 71.48,31.52 v55.55,31.52
  Bottom 0.254: v55.55,31.52 53.41,33.66 IC4.2 | R13.2 73.06,29.93 JP5.2
N$23
  Bottom 0.254: U2.8 62.87,41.53 JP3.2
N$25  (via drill 0.51 pad 0.81)
  Top 0.254: M1.54 33.77,42.02 33.77,36.83 v32.23,35.29
  Bottom 0.254: JP8.1 32.23,24.69 v32.23,35.29
N$26
  Bottom 0.254: U2.7 59.68,42.15 JP2.2
N$28
  Bottom 0.254: R5.1 JP1.1
RA  (via drill 0.51 pad 0.81)
  Top 0.254: JP4.2 63.15,20.83 58.82,25.16 v55.48,25.16
  Bottom 0.254: v55.48,25.16 53.34,27.3 IC3.2 | R12.2 73.06,20.41 JP4.2
RAIN  (via drill 0.51 pad 0.81)
  Top 0.254: v36.86,31.76 v28.48,31.76
  Bottom 0.254: v36.86,31.76 36.86,32.6 37.47,33.21 M1.51 | 20.95,5.79 21.39,5.79 D1.A | D2.C 20.52,5.79 20.95,5.79 | 20.95,5.79 R4.1 21.83,7.64 21.83,8.88 23.42,10.47 23.42,12.1 28.48,17.17 28.48,17.24 28.52,17.27 28.52,20.82 28.48,20.86 v28.48,31.76
RX0
  Bottom 0.254: U3.15 39.28,32.11 39.48,31.9 39.74,31.9 41.73,29.91 41.73,21.13 M1.28
RXA  (via drill 0.51 pad 0.81)
  Top 0.254: v63.63,21.84 57.81,27.66 v55.55,27.66
  Bottom 0.254: IC3.1 54.96,28.25 v55.55,27.66 | J2.2 71.68,9.27 63.63,17.32 v63.63,21.84
RXB  (via drill 0.51 pad 0.81)
  Top 0.254: J3.2 v57.4,9.27
  Bottom 0.254: IC4.1 53.52,34.61 56.6,31.52 56.6,20.86 56.57,20.82 56.57,17.27 56.6,17.24 56.6,15.98 57.4,15.19 v57.4,9.27
RXD
  Top 0.254: J4.2 39.24,9.41 36.73,11.92 31.42,11.92 25.98,17.35 25.98,18.29 25.27,19 24.34,19 23.02,20.32 M1.12
SCLX
  Top 0.203: J3.7 49.21,7.49 48.23,8.48 39.83,8.48 39.24,7.89 39.24,7.1 38.66,6.52 35.14,6.52 J4.7
  Bottom 0.254: J4.7 33.4,7.49 30.65,10.24 30.65,15.4 32.38,17.13 M1.19 | J3.7 51.94,5.97 57.09,5.97 58.62,7.49 62.87,7.49 | JP3.1 63.31,44.03 R2.1 66.67,43.85 67.5,43.02 67.5,41.63 63.16,37.28 63.16,30.44 63.37,30.23 63.37,29.02 62.91,28.56 62.91,22.17 62.89,22.14 62.89,21.53 62.91,21.51 62.91,7.54 62.87,7.49 | 62.87,7.49 J2.7
SDAX  (via drill 0.51 pad 0.81)
  Top 0.254: M1.56 33.56,44.36 52.39,44.36 v52.78,43.97 | 52.45,6.6 52.45,6.51 54.02,6.51 54.06,6.46 57.09,6.46 57.9,7.27 64.37,7.27 65.29,6.35 67.56,6.35 J2.5 | v41.88,7.44 47.94,7.44 48.88,6.51 49.95,6.51 49.99,6.46 52.31,6.46 52.45,6.6 | J3.5 52.45,6.6
  Bottom 0.254: v41.88,7.44 40.92,6.49 40.71,6.49 40.69,6.46 37.22,6.46 J4.5 35.19,6.49 34.61,6.49 34.59,6.46 33.74,6.46 30.16,10.04 30.16,15.88 31.06,16.77 31.06,17.27 31.06,31.4 28.58,33.88 28.58,43.69 29.34,44.45 31.12,44.45 M1.56 | v52.78,43.97 55.18,43.97 R1.1 55.69,43.59 JP2.1
TX0
  Bottom 0.254: M1.30 44.32,20.32 43.05,19.05 43,19.1 42.04,19.1 41.27,19.87 41.27,29.72 39.55,31.45 U3.14
TXA  (via drill 0.51 pad 0.81)
  Top 0.254: v40.5,28.07 44.69,23.87 59.44,23.87 72.77,10.54 J2.1
  Bottom 0.254: U3.12 39.05,30.15 39.38,29.82 39.38,29.19 v40.5,28.07
TXB  (via drill 0.51 pad 0.81)
  Top 0.254: v40.2,29.53 47.07,29.53 v51.79,24.81
  Bottom 0.254: J3.1 56.52,14.55 53.98,17.09 53.98,22.62 v51.79,24.81 | U3.13 39.08,30.81 40.2,29.69 v40.2,29.53
TXD  (via drill 0.51 pad 0.81)
  Top 0.254: v40.51,10.05 37.62,12.94 33.01,12.94 29.38,16.56 29.34,16.56 28.58,17.33 28.58,20.77 27.81,21.54 20.9,21.54 M1.10
  Bottom 0.254: v40.51,10.05 40.51,7.75 J4.1
WDIR
  Bottom 0.254: 7.88,3.68 D4.A 8.43,3.14 R11.2 | R9.1 7.88,3.68 | 7.88,3.68 6.47,3.68 D3.C | R9.1 | M1.14 23.5,19.05 23.5,17.33 22.73,16.56 22.68,16.56 21.5,15.38 20.61,15.38 19.56,14.32 19.56,13.28 13.92,7.64 8.75,7.64 R9.1
WSPEED  (via drill 0.51 pad 0.81)
  Top 0.254: M1.49 31.95,32.59 25.17,32.59 14.12,21.54 14.1,21.54 13.34,20.77 13.34,16.24 9.67,12.57 9.65,12.57 9.14,12.06 9.14,10.78 6.55,8.19 v4.49,8.19
  Bottom 0.254: R10.1 4,8.68 v4.49,8.19 4.49,7.57 D6.C 5.59,4.71 D5.A

### Text on the board
tPlace: Level and Weather | Invert | Range 2 | Invert | Range 1 | Wind | Rain | DS18B20 Temp | Range 2 | Range 1
bPlace: sentientthings.com / February 2019
bNames: SDAX | SCLX | 1WIRE | MPL INT1 | WAKE | TX / RX / GPIO / VCC / SDA / 3V3SW / SCL / GND | TX / RX / GPIO / VCC / SDA / 3V3SW / SCL / GND | TX / RX / GPIO / VCC / SDA / 3V3SW / SCL / GND
_tsilk: Weather and Level | www.sentientthings.com / Oct 2018 v2 | Rx Invert | Rx Invert | Wind | Rain | Water Temp | Temp Humid | Range Two | Range One